# EAGLE schematic witch-transfer1 (EAGLE 6.4)
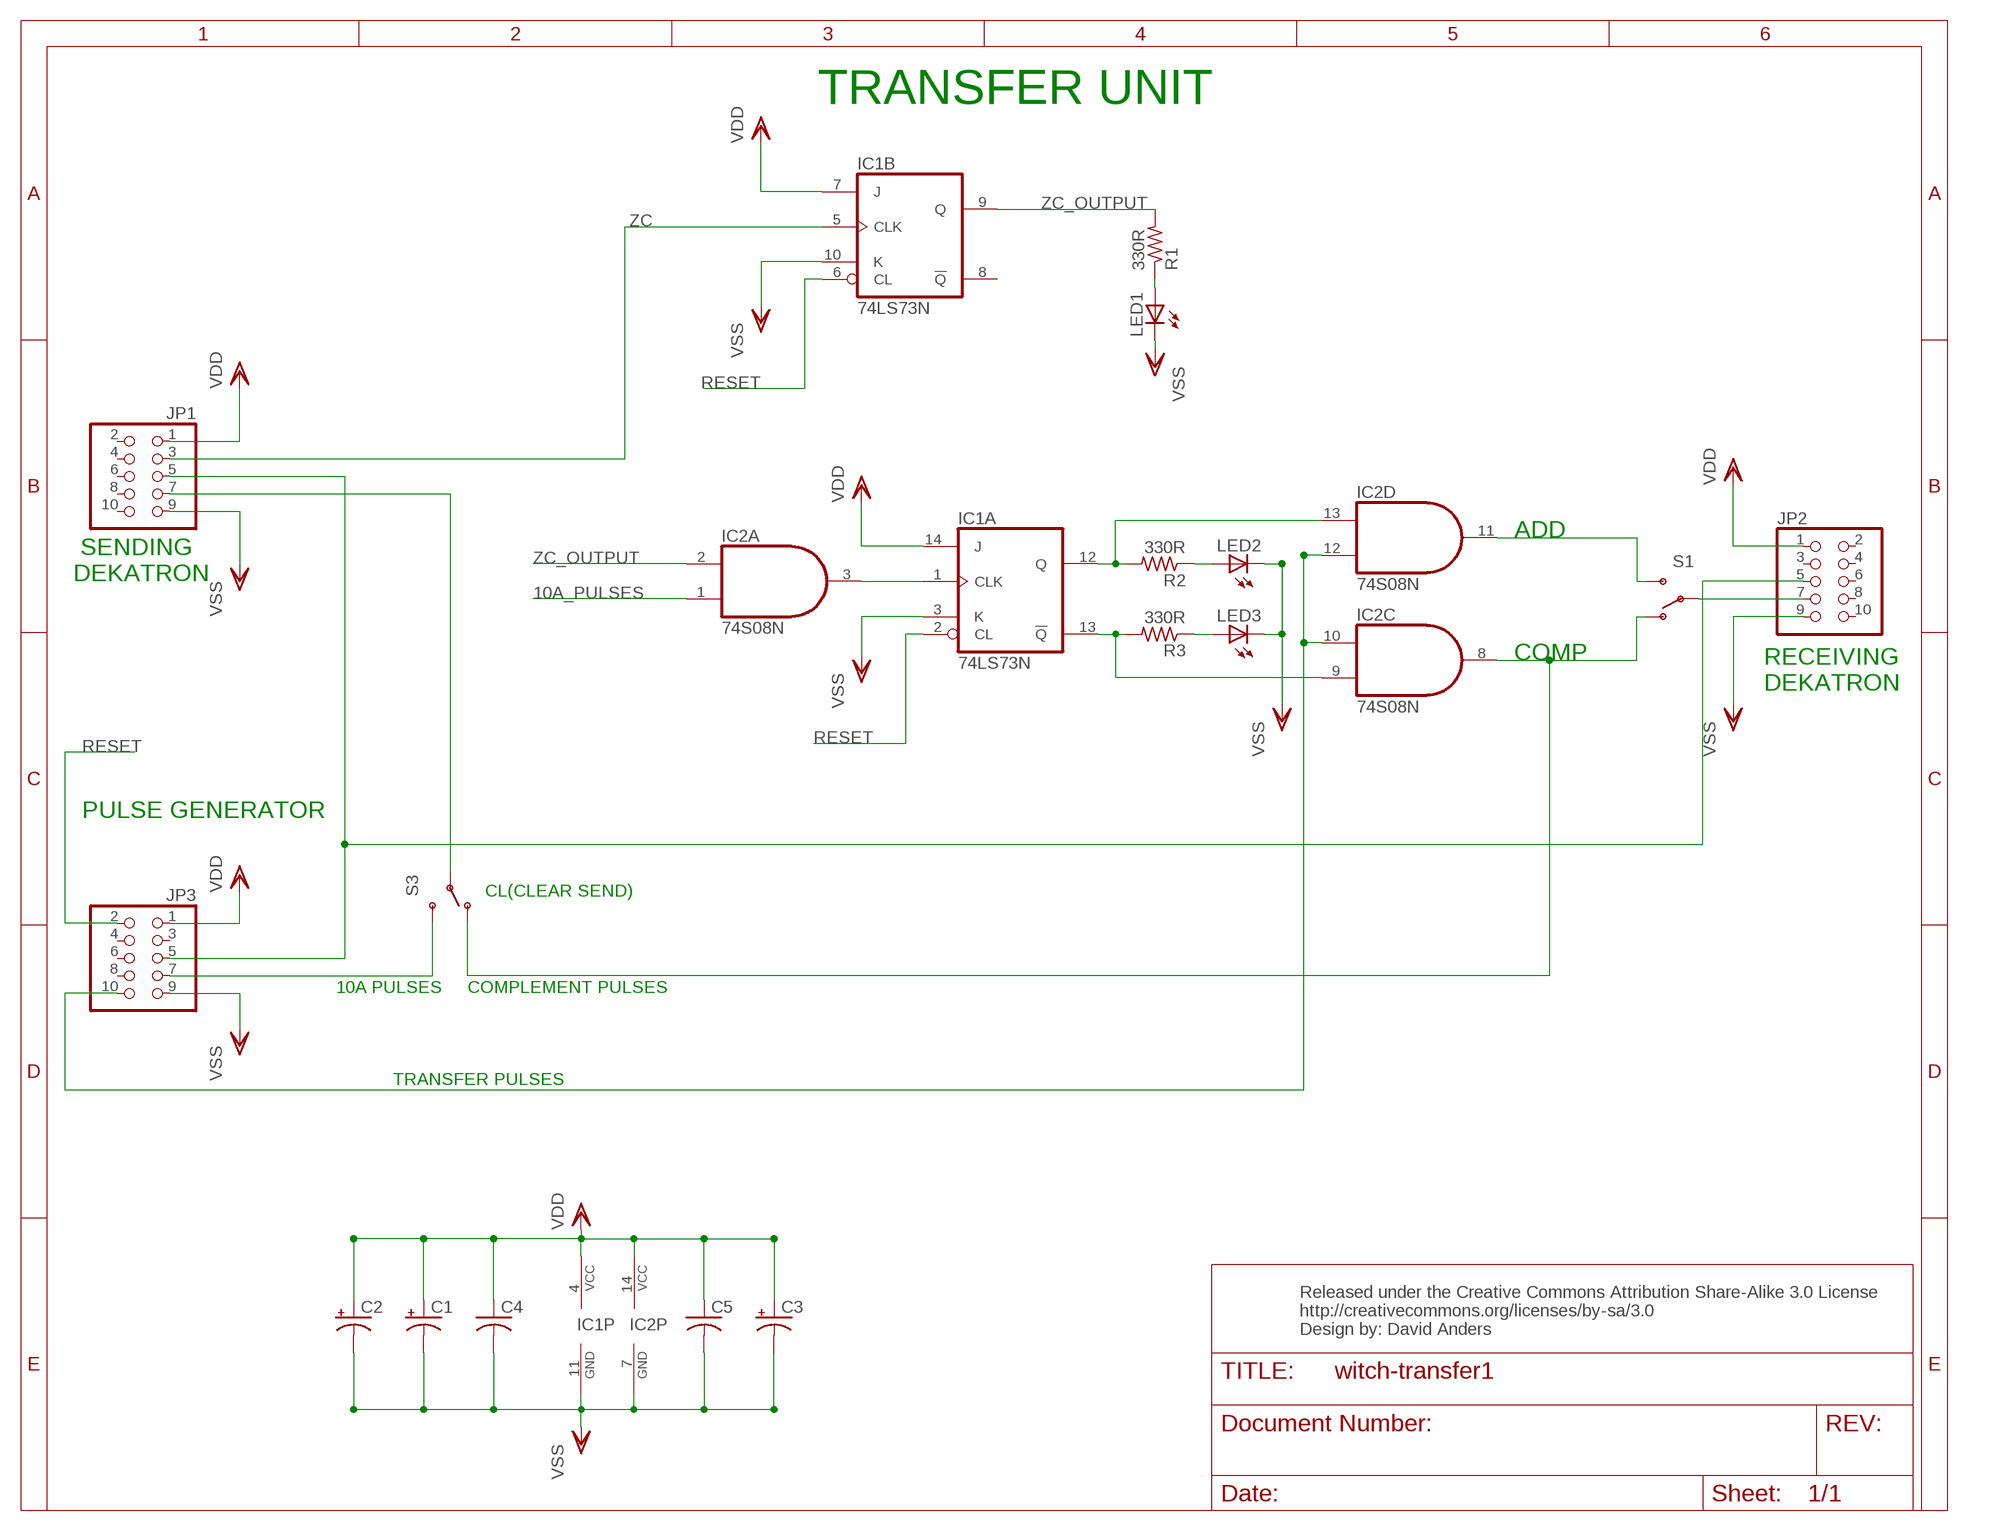
[diagram p0: schematic, sheet 1]

## Parts
C1  CPOL-USE2-5  [E2-5]
C2  CPOL-USE2-5  [E2-5]
C3  CPOL-USE2-5  [E2-5]
C4  C-US025-025X050  [C025-025X050]
C5  C-US025-025X050  [C025-025X050]
IC1  74LS73N  [DIL14]
IC2  74S08N  [DIL14]
JP1  PINHD-2X5  [2X05]
JP2  PINHD-2X5  [2X05]
JP3  PINHD-2X5  [2X05]
LED1  LED5MM  [LED5MM]
LED2  LED5MM  [LED5MM]
LED3  LED5MM  [LED5MM]
R1  330R  R-US_0204/5  [0204/5]
R2  330R  R-US_0204/5  [0204/5]
R3  330R  R-US_0204/5  [0204/5]
S1  SWITCH-SPDTPTH  [SWITCH-SPDT]
S3  SWITCH-SPDTPTH  [SWITCH-SPDT]

## Nets
10A_PULSES: IC2.1(A:I0) JP3.7 S3.3(S)
N$1: JP2.7 S1.2(P)
N$2: IC2.10(C:I1) IC2.12(D:I0) JP3.10
N$3: IC1.13(A:!Q) IC2.9(C:I0) R3.2
N$4: IC1.12(A:Q) IC2.13(D:I1) R2.2
N$5: IC2.11(D:O) S1.3(S)
N$6: LED2.A R2.1
N$7: LED3.A R3.1
N$8: LED1.A R1.1
N$11: IC1.1(A:CLK) IC2.3(A:O)
N$32: JP1.5 JP2.5 JP3.5
N$43: IC2.8(C:O) S1.1(O) S3.1(O)
RESET: IC1.2(A:CL) IC1.6(B:CL) JP3.2
TRANSFER_PULSE: JP1.7 S3.2(P)
VDD: C1.+ C2.+ C3.+ C4.1 C5.1 IC1.4(P:VCC) IC1.7(B:J) IC1.14(A:J) IC2.14(P:VCC) JP1.1 JP2.1 JP3.1
VSS: C1.- C2.- C3.- C4.2 C5.2 IC1.3(A:K) IC1.10(B:K) IC1.11(P:GND) IC2.7(P:GND) JP1.9 JP2.9 JP3.9 LED1.K(C) LED2.K(C) LED3.K(C)
ZC: IC1.5(B:CLK) JP1.3
ZC_OUTPUT: IC1.9(B:Q) IC2.2(A:I1) R1.2
Unconnected: IC1.8(B:!Q) IC2.4(B:I0) IC2.5(B:I1) IC2.6(B:O) JP1.2 JP1.4 JP1.6 JP1.8 JP1.10 JP2.2 JP2.3 JP2.4 JP2.6 JP2.8 JP2.10 JP3.3 JP3.4 JP3.6 JP3.8

## Notes on the sheet
- TRANSFER UNIT
- ADD
- SENDING
  DEKATRON
- COMP
- RECEIVING
  DEKATRON
- PULSE GENERATOR
- CL(CLEAR SEND)
- 10A PULSES | COMPLEMENT PULSES
- TRANSFER PULSES
- Released under the Creative Commons Attribution Share-Alike 3.0 License
  http://creativecommons.org/licenses/by-sa/3.0
  Design by: David Anders

## Library data of the parts
C1-C3 = resistor:CPOL-US: POLARIZED CAPACITOR, American symbol
C4 C5 = resistor:C-US: CAPACITOR, American symbol
IC1 = 74xx-us:74*73: Dual J-K FLIP FLOP, clear
IC2 = 74xx-us:74*08: Quad 2-input AND gate
JP1-JP3 = pinhead:PINHD-2X5: PIN HEADER
LED1-LED3 = SparkFun-LED:LED: LEDs Standard schematic elements and footprints for 5mm, 3mm, 1206, and 0603 sized LEDs. 5mm - Spark Fun Electronics SKU : COM-00529 (and others)
R1-R3 = resistor:R-US_: RESISTOR, American symbol
S1 S3 = SparkFun-Electromechanical:SWITCH-SPDT: SPDT Switch Simple slide switch, Spark Fun Electronics SKU : COM-00102 DPDT SMT slide switch, AYZ0202, SWCH-08179